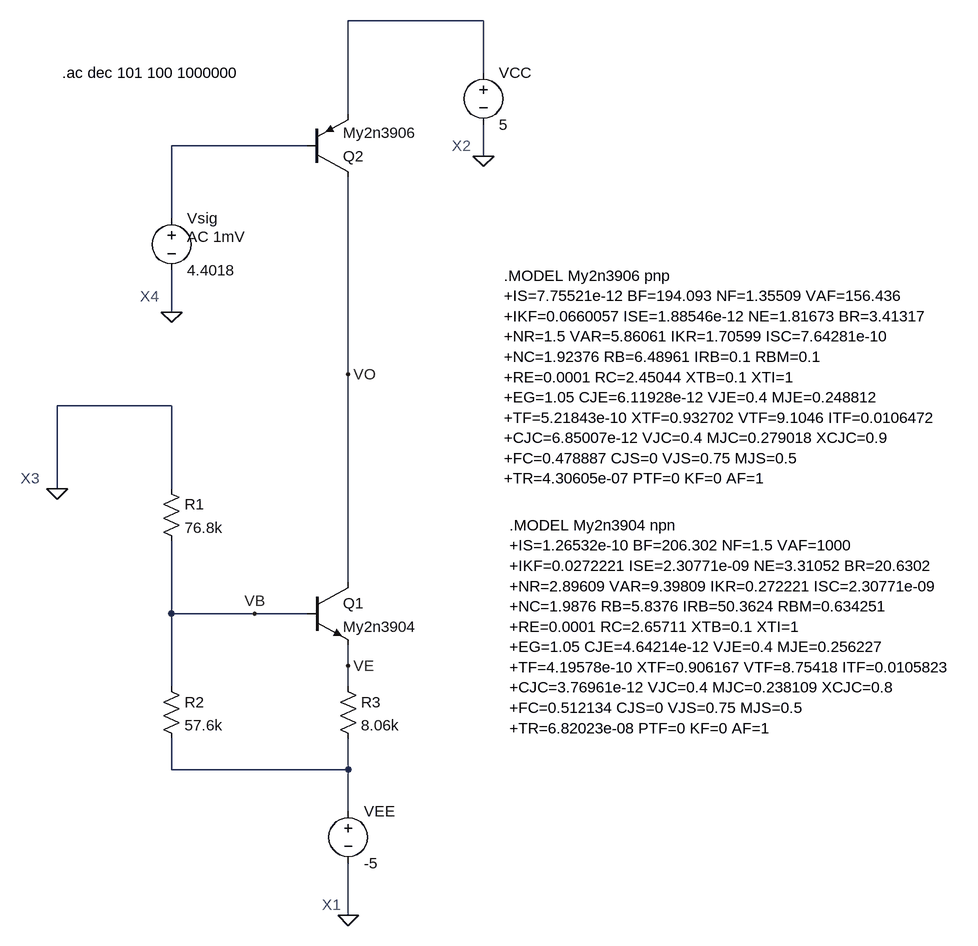
[diagram p0: schematic Part1B.asc]
Part1B.asc, the LTspice schematic file:
Version 4
SHEET 1 1056 680
WIRE 192 -848 -16 -848
WIRE 192 -768 192 -848
WIRE -16 -704 -16 -848
WIRE -80 -656 -288 -656
WIRE 192 -640 192 -688
WIRE -288 -544 -288 -656
WIRE -288 -400 -288 -464
WIRE -16 -304 -16 -608
WIRE -288 -256 -464 -256
WIRE -464 -128 -464 -256
WIRE -288 -128 -288 -256
WIRE -16 16 -16 -304
WIRE -288 64 -288 -48
WIRE -160 64 -288 64
WIRE -80 64 -160 64
WIRE -16 144 -16 112
WIRE -288 176 -288 64
WIRE -16 176 -16 144
WIRE -288 304 -288 256
WIRE -16 304 -16 256
WIRE -16 304 -288 304
WIRE -16 368 -16 304
WIRE -16 528 -16 448
FLAG -464 -128 0
FLAG -16 528 0
FLAG -160 64 VB
FLAG -16 -304 VO
FLAG -16 144 VE
FLAG -288 -400 0
FLAG 192 -640 0
SYMBOL res -304 -144 R0
SYMATTR InstName R1
SYMATTR Value 76.8k
SYMBOL res -304 160 R0
SYMATTR InstName R2
SYMATTR Value 57.6k
SYMBOL res -32 160 R0
SYMATTR InstName R3
SYMATTR Value 8.06k
SYMBOL voltage -16 352 R0
WINDOW 123 0 0 Left 0
WINDOW 39 0 0 Left 0
SYMATTR InstName VEE
SYMATTR Value -5
SYMBOL npn -80 16 R0
SYMATTR InstName Q1
SYMATTR Value My2n3904
SYMBOL pnp -80 -608 M180
SYMATTR InstName Q2
SYMATTR Value My2n3906
SYMBOL voltage 192 -784 R0
WINDOW 123 0 0 Left 0
WINDOW 39 0 0 Left 0
SYMATTR InstName VCC
SYMATTR Value 5
SYMBOL voltage -288 -560 R0
WINDOW 123 24 44 Left 2
WINDOW 39 0 0 Left 0
SYMATTR Value2 AC 1mV
SYMATTR InstName Vsig
SYMATTR Value 4.4018
TEXT -520 -144 Left 2 ;X3
TEXT -56 512 Left 2 ;X1
TEXT 232 -72 Left 2 !.MODEL My2n3904 npn\n+IS=1.26532e-10 BF=206.302 NF=1.5 VAF=1000\n+IKF=0.0272221 ISE=2.30771e-09 NE=3.31052 BR=20.6302\n+NR=2.89609 VAR=9.39809 IKR=0.272221 ISC=2.30771e-09\n+NC=1.9876 RB=5.8376 IRB=50.3624 RBM=0.634251\n+RE=0.0001 RC=2.65711 XTB=0.1 XTI=1\n+EG=1.05 CJE=4.64214e-12 VJE=0.4 MJE=0.256227\n+TF=4.19578e-10 XTF=0.906167 VTF=8.75418 ITF=0.0105823\n+CJC=3.76961e-12 VJC=0.4 MJC=0.238109 XCJC=0.8\n+FC=0.512134 CJS=0 VJS=0.75 MJS=0.5\n+TR=6.82023e-08 PTF=0 KF=0 AF=1
TEXT 224 -456 Left 2 !.MODEL My2n3906 pnp\n+IS=7.75521e-12 BF=194.093 NF=1.35509 VAF=156.436\n+IKF=0.0660057 ISE=1.88546e-12 NE=1.81673 BR=3.41317\n+NR=1.5 VAR=5.86061 IKR=1.70599 ISC=7.64281e-10\n+NC=1.92376 RB=6.48961 IRB=0.1 RBM=0.1\n+RE=0.0001 RC=2.45044 XTB=0.1 XTI=1\n+EG=1.05 CJE=6.11928e-12 VJE=0.4 MJE=0.248812\n+TF=5.21843e-10 XTF=0.932702 VTF=9.1046 ITF=0.0106472\n+CJC=6.85007e-12 VJC=0.4 MJC=0.279018 XCJC=0.9\n+FC=0.478887 CJS=0 VJS=0.75 MJS=0.5\n+TR=4.30605e-07 PTF=0 KF=0 AF=1
TEXT 144 -656 Left 2 ;X2
TEXT -336 -424 Left 2 ;X4
TEXT -456 -768 Left 2 !.ac dec 101 100 1000000

The netlist it stands for:
* Part1B.asc
R1 0 VB 76.8k
R2 VB N003 57.6k
R3 VE N003 8.06k
VEE N003 0 -5
Q1 VO VB VE 0 My2n3904
Q2 VO N002 N001 0 My2n3906
VCC N001 0 5
Vsig N002 0 4.4018 AC 1mV
.model NPN NPN
.model PNP PNP
.lib standard.bjt
* X3
* X1
.MODEL My2n3904 npn
+IS=1.26532e-10 BF=206.302 NF=1.5 VAF=1000
+IKF=0.0272221 ISE=2.30771e-09 NE=3.31052 BR=20.6302
+NR=2.89609 VAR=9.39809 IKR=0.272221 ISC=2.30771e-09
+NC=1.9876 RB=5.8376 IRB=50.3624 RBM=0.634251
+RE=0.0001 RC=2.65711 XTB=0.1 XTI=1
+EG=1.05 CJE=4.64214e-12 VJE=0.4 MJE=0.256227
+TF=4.19578e-10 XTF=0.906167 VTF=8.75418 ITF=0.0105823
+CJC=3.76961e-12 VJC=0.4 MJC=0.238109 XCJC=0.8
+FC=0.512134 CJS=0 VJS=0.75 MJS=0.5
+TR=6.82023e-08 PTF=0 KF=0 AF=1
.MODEL My2n3906 pnp
+IS=7.75521e-12 BF=194.093 NF=1.35509 VAF=156.436
+IKF=0.0660057 ISE=1.88546e-12 NE=1.81673 BR=3.41317
+NR=1.5 VAR=5.86061 IKR=1.70599 ISC=7.64281e-10
+NC=1.92376 RB=6.48961 IRB=0.1 RBM=0.1
+RE=0.0001 RC=2.45044 XTB=0.1 XTI=1
+EG=1.05 CJE=6.11928e-12 VJE=0.4 MJE=0.248812
+TF=5.21843e-10 XTF=0.932702 VTF=9.1046 ITF=0.0106472
+CJC=6.85007e-12 VJC=0.4 MJC=0.279018 XCJC=0.9
+FC=0.478887 CJS=0 VJS=0.75 MJS=0.5
+TR=4.30605e-07 PTF=0 KF=0 AF=1
* X2
* X4
.ac dec 101 100 1000000
.backanno
.end